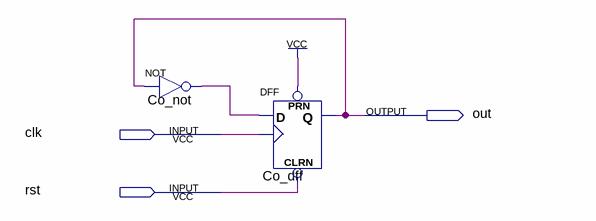
[diagram p0: schematic sheet]
// Quartus schematic fdiv.bdf as structural Verilog: 2 symbols, 3 pins
module fdiv (
  input  clk,
  input  rst,
  output out
);

  wire Co_not_out;

  not Co_not (Co_not_out, out);
  DFF Co_dff (.CLRN(rst), .CLK(clk), .D(Co_not_out), .PRN(1'b1), .Q(out));
endmodule
